# Altium schematic sheet Micro Controller.SchDoc
size A4; SheetNumber: 4; SheetTotal: 6; ProjectTitle: PD_SMARTKEY_EMN-EVAN_V2
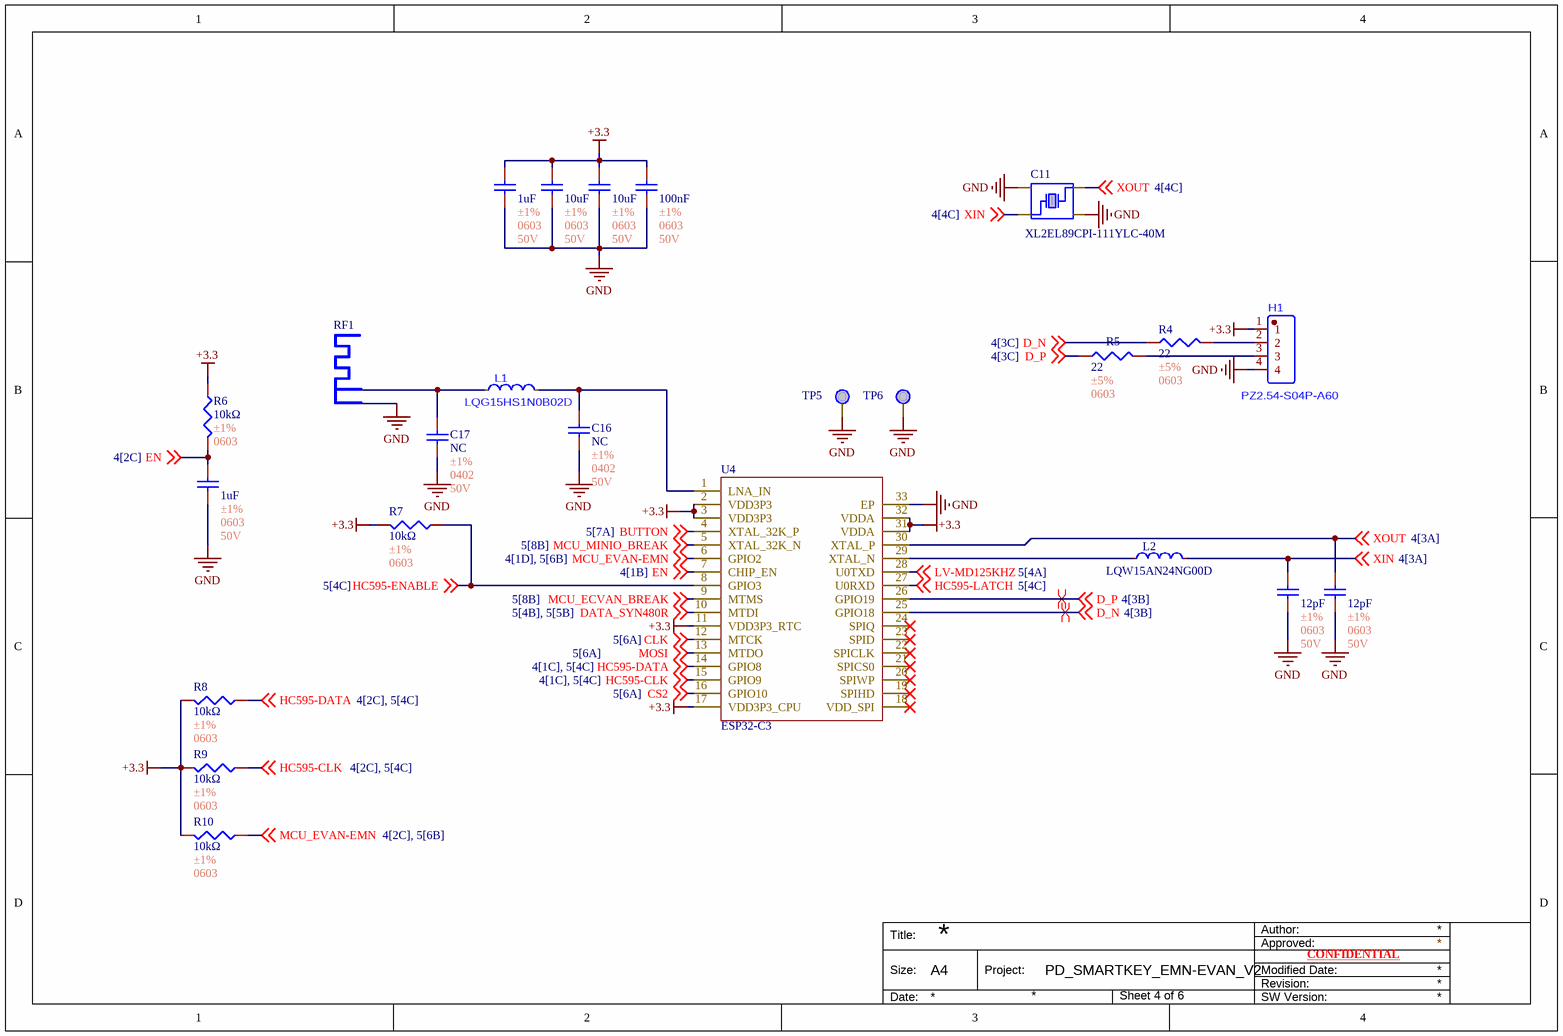
[diagram p0: Micro Controller.SchDoc]

## Parts
C11  XL2EL89CPI-111YLC-40M  [XL2EL89CPI-111YLC-40M]
C12  1uF  Tolerance: ±1%  Package: 0603  Voltage Rating: 50V  [C0603]
C13  10uF  Tolerance: ±1%  Package: 0603  Voltage Rating: 50V  [C0603]
C14  10uF  Tolerance: ±1%  Package: 0603  Voltage Rating: 50V  [C0603]
C15  100nF  Tolerance: ±1%  Package: 0603  Voltage Rating: 50V  [C0603]
C16  NC  Tolerance: ±1%  Package: 0402  Voltage Rating: 50V  [C0402]
C17  NC  Tolerance: ±1%  Package: 0402  Voltage Rating: 50V  [C0402]
C18  1uF  Tolerance: ±1%  Package: 0603  Voltage Rating: 50V  [C0603]
C19  12pF  Tolerance: ±1%  Package: 0603  Voltage Rating: 50V  [C0603]
C20  12pF  Tolerance: ±1%  Package: 0603  Voltage Rating: 50V  [C0603]
H1  PZ2.54-S04P-A60  [J_4P_XH2.54]
L1  LQG15HS1N0B02D  [L0402_1nH]
L2  LQW15AN24NG00D  [LQW15AN24NG00D]
R4  22  Tolerance: ±5%  Package: 0603  [R0603]
R5  22  Tolerance: ±5%  Package: 0603  [R0603]
R6  10kΩ  Tolerance: ±1%  Package: 0603  [R0603]
R7  10kΩ  Tolerance: ±1%  Package: 0603  [R0603]
R8  10kΩ  Tolerance: ±1%  Package: 0603  [R0603]
R9  10kΩ  Tolerance: ±1%  Package: 0603  [R0603]
R10  10kΩ  Tolerance: ±1%  Package: 0603  [R0603]
RF1  (no value)  [2.4GHZ-50OHMS_v1.1]
TP5  TP  [TP]  (value not drawn)
TP6  TP  [TP]  (value not drawn)
U4  ESP32-C3  [ESP32-C3]

## Nets
+3.3: C12.1 C13.1 C14.1 C15.1 H1.1 R6.1 R7.2 R8.2 R9.2 R10.2 U4.2(VDD3P3) U4.3(VDD3P3) U4.11(VDD3P3_RTC) U4.17(VDD3P3_CPU) U4.31(VDDA) U4.32(VDDA)
GND: C11.2 C11.4 C12.2 C13.2 C14.2 C15.2 C16.2 C17.2 C18.2 C19.2 C20.2 H1.4 RF1.2 TP5.1 TP6.1 U4.33(EP)
BUTTON: U4.4(XTAL_32K_P) ; off-sheet BUTTON
CLK: U4.12(MTCK) ; off-sheet CLK
CS2: U4.16(GPIO10) ; off-sheet CS2
D_N: R4.1 U4.25(GPIO18) ; off-sheet D_N
D_P: R5.1 U4.26(GPIO19) ; off-sheet D_P
DATA_SYN480R: U4.10(MTDI) ; off-sheet DATA_SYN480R
EN: C18.1 R6.2 U4.7(CHIP_EN) ; off-sheet EN
HC595-CLK: R9.1 U4.15(GPIO9) ; off-sheet HC595-CLK
HC595-DATA: R8.1 U4.14(GPIO8) ; off-sheet HC595-DATA
HC595-ENABLE: R7.1 U4.8(GPIO3) ; off-sheet HC595-ENABLE
HC595-LATCH: U4.27(U0RXD) ; off-sheet HC595-LATCH
LV-MD125KHZ: U4.28(U0TXD) ; off-sheet LV-MD125KHZ
MCU_ECVAN_BREAK: U4.9(MTMS) ; off-sheet MCU_ECVAN_BREAK
MCU_EVAN-EMN: R10.1 U4.6(GPIO2) ; off-sheet MCU_EVAN-EMN
MCU_MINIO_BREAK: U4.5(XTAL_32K_N) ; off-sheet MCU_MINIO_BREAK
MOSI: U4.13(MTDO) ; off-sheet MOSI
XIN: C11.1 C19.1 L2.2 ; off-sheet XIN
XOUT: C11.3 C20.1 U4.30(XTAL_P) ; off-sheet XOUT
NetC16_1: C16.1 L1.2 U4.1(LNA_IN)
NetC17_1: C17.1 L1.1 RF1.1
NetH1_2: H1.2 R4.2
NetH1_3: H1.3 R5.2
NetL2_1: L2.1 U4.29(XTAL_N)

Not connected (* = marked no-connect by the designer): U4 18(VDD_SPI)* 19(SPIHD)* 20(SPIWP)* 21(SPICS0)* 22(SPICLK)* 23(SPID)* 24(SPIQ)*

## Layout directives
differential pair: D_N, D_P

## Notes on the sheet
- Author:
- Title:
- Size:
- A4
- Project:
- Approved:
- Revision:
- Modified Date:
- CONFIDENTIAL
- Date:
- SW Version:

## Library data of the parts
C11 = XL2EL89CPI-111YLC-40M: Crystal Oscillator 15pF SMD3225-4P Crystals RoHS; Manufacturer: YXC Crystal Oscillators; Mfr. Part #: XL2EL89CPI-111YLC-40M; LCSC Part #: C5444549; Package: SMD3225-4P; Link: https://www.lcsc.com/product-detail/C5444549.html?s_z=n_oscillator; Key Attributes: Crystal Oscillator 15pF SMD3225-4P Crystals RoHS
C12 C18 = C0603_1uF_±1%: 50V 10pF NP0 ±1% 0402 Multilayer Ceramic Capacitors MLCC - SMD/SMT ROHS; Manufacturer: YAGEO; Mfr. Part #: CC0402FRNPO9BN100; LCSC Part #: C513681; Link: https://www.lcsc.com/product-detail/C513681.html?s_z=n_capital%2520yageo%252010pF%25200402; Capacitance: 1uF
C13 C14 = C0603_10uF_±1%: 50V 10pF NP0 ±1% 0402 Multilayer Ceramic Capacitors MLCC - SMD/SMT ROHS; Manufacturer: YAGEO; Mfr. Part #: CC0402FRNPO9BN100; LCSC Part #: C513681; Link: https://www.lcsc.com/product-detail/C513681.html?s_z=n_capital%2520yageo%252010pF%25200402; Capacitance: 10uF
C15 = C0603_100nF_±1%: 50V 10pF NP0 ±1% 0402 Multilayer Ceramic Capacitors MLCC - SMD/SMT ROHS; Manufacturer: YAGEO; Mfr. Part #: CC0402FRNPO9BN100; LCSC Part #: C513681; Link: https://www.lcsc.com/product-detail/C513681.html?s_z=n_capital%2520yageo%252010pF%25200402; Capacitance: 100nF
C16 C17 = C0402_NC_±1%: Manufacturer: YAGEO; Mfr. Part #: CC0402FRNPO9BN100; Capacitance: 1uF; LCSC Part #: C513681; Link: https://www.lcsc.com/product-detail/C513681.html?s_z=n_capital%2520yageo%252010pF%25200402
C19 C20 = C0603_12pF_±1%: 50V 10pF NP0 ±1% 0402 Multilayer Ceramic Capacitors MLCC - SMD/SMT ROHS; Manufacturer: YAGEO; Mfr. Part #: CC0402FRNPO9BN100; LCSC Part #: C513681; Link: https://www.lcsc.com/product-detail/C513681.html?s_z=n_capital%2520yageo%252010pF%25200402; Capacitance: 12pF
H1 = J_4P_XH2.54: 1kV 1 2.54mm Pin Header 3A 2.5mm Through Hole 6mm -40℃~+105℃ 3mm Gold 4P Black 1x4P Through Hole,P=2.54mm Headers, Male Pins RoHS; Manufacturer: JXTCONN; MPN: PZ2.54-S04P-A60; LCSC Part #: C42431795; Packaging: Through Hole,P=2.54mm; Link: https://www.lcsc.com/product-detail/C42431795.html?s_z=n_q_t_header%25204%2520p&spm=wm.fly.bg.0.xh___wm.ssy.tc.0.tz&lcsc_vid=FlRcBlcDRFNZAlJQT1RZBVJSEVFcX11eRVQPBFEHFgAxVlNeQVVcV1RRRlFeUzsOAxUeFF5JWBYZEEoKFBINSQcJGk4dAgUUFAk%3D
L1 = L0402_1nH: FIXED IND 1nH 1A 70mΩ 0402; Manufacturer: muRata; MPN: LQG15HS1N0B02D; LCSC Part #: C162538; Packaging: 0402; Link: https://www.lcsc.com/product-detail/C162538.html?s_z=n_q_0402%2520inductor%25201nH&spm=wm.fly.bg.1.xh&lcsc_vid=FFlaVlZURFlbX1EAE1lbUlZfQwdeBlBRQ1VZBFdQQwUxVlNeQ1FfVlBVRFlZVjsOAxUeFF5JWBYZEEoKFBINSQcJGk4NBhADEA4cHktXRllfSQwSGg0%3D
L2 = LQW15AN24NG00D: FIXED IND 24nH 280mA 520mΩ 0402; Manufacturer: muRata; Mfr. Part #: LQW15AN24NG00D; LCSC Part #: C167472; Package: 0402; Link: https://www.lcsc.com/product-detail/C167472.html?s_z=n_q_inductor%252024nH%25200402&spm=wm.fly.bg.0.xh&lcsc_vid=FlRcBlcDRFNZAlJQT1RZBVJSEVFcX11eRVQPBFEHFgAxVlNeQVRfUFJVQVNZUzsOAxUeFF5JWBYZEEoKFBINSQcJGk4eFQsCAgIaSgADAwAHC0slRlhdU1RSWQkaCgg%3D
R4 R5 = R0603_0Ω_±5%: 100mW Thick Film Resistor 75V ±5% 0Ω 0603 Chip Resistor - Surface Mount ROHS; Manufacturer: YAGEO; Mfr. Part #: RC0603JR-070RL; Key Attributes: RES 0Ω ±5% 100mW 0603; LCSC Part #: C95177; Resistance: 0Ω; Link: https://www.lcsc.com/product-detail/C138066.html?s_z=n_resistor%25200402%252010R
R6-R10 = R0603_10kΩ_±1%: 62.5mW Thick Film Resistor 50V ±1% ±200ppm/℃ 10Ω 0402 Chip Resistor - Surface Mount ROHS; Manufacturer: YAGEO; Mfr. Part #: RC0402FR-0710RL; LCSC Part #: C138066; Resistance: 10kΩ; Link: https://www.lcsc.com/product-detail/C138066.html?s_z=n_resistor%25200402%252010R
RF1 = Antenna
U4 = ESP32-C3: Others 160MHz QFN-32-EP(5x5) RF Transceiver Modules and Modems RoHS; Manufacturer: ESPRESSIF; LCSC Part #: C2838500; Package: QFN-32-EP(5x5); Link: https://www.lcsc.com/product-detail/C2838500.html?s_z=n_ESP32%2520C3; MPN: ESP32-C3